# Altium project Charge_Deck.PrjPCB
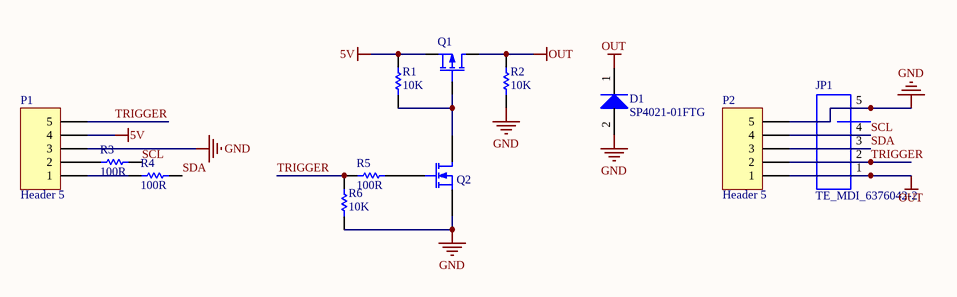
[diagram p0: Charge_Deck.SchDoc]
1 sheet, 12 parts. Net scope: global (net labels, ports and power ports of the same name join across sheets).
Board file: Charge_Deck.PcbDoc

## Sheet Charge_Deck.SchDoc
size A4

### Parts
D1  SP4021-01FTG  [SOD-323]
JP1  TE_MDI_6376042-2  [TE_6376042-2]
P1  Header 5  [HDR1X5]
P2  Header 5  [HDR1X5]
Q1  SI2309CDS-T1-GE3  [SOT23-3]  (value not drawn)
Q2  BSS123WQ-7-F  [SOT323-3]  (value not drawn)
R1  value 10K  [R0603[1608]]  (hidden comment: 10K 1% 0603)
R2  value 10K  [R0603[1608]]  (hidden comment: 10K 1% 0603)
R3  value 100R  [R0603[1608]]  (hidden comment: 100R 1% 0603)
R4  value 100R  [R0603[1608]]  (hidden comment: 100R 1% 0603)
R5  value 100R  [R0603[1608]]  (hidden comment: 100R 1% 0603)
R6  value 10K  [R0603[1608]]  (hidden comment: 10K 1% 0603)

### Nets
5V: P1.4 Q1.3(S) R1.2
GND: D1.2(A) JP1.5 P1.3 P2.5 Q2.2(S) R2.1 R6.1
OUT: D1.1(K) JP1.1 P2.1 Q1.2(D) R2.2
SCL: JP1.4 P2.4 R3.1
SDA: JP1.3 P2.3 R4.1
TRIGGER: JP1.2 P1.5 P2.2 R5.2 R6.2
NetP1_1: P1.1 R4.2
NetP1_2: P1.2 R3.2
NetQ1_1: Q1.1(G) Q2.3(D) R1.1
NetQ2_1: Q2.1(G) R5.1

### Library data of the parts
D1 = SP4021-01FTG: Manufacturer: Littelfuse; PartNumber: SP4021-01FTG; PackageReference: SOD-323-2; Mounting Technology: Surface Mount
JP1 = TE_MDI_6376042-2: BLADE CONNECTOR, 5 PIN, MALE, HORIZ; Manufacturer: TE Connectivity; PartNumber: 6376042-2; Mounting Technology: Through Hole
P1 P2 = Header 5: Header, 5-Pin; LatestRevisionDate: 17-Jul-2002; LatestRevisionNote: Re-released for DXP Platform.; Publisher: Altium Limited
Q1 = SI2309CDS-T1-GE3: P-Channel MOSFET; Manufacturer: Vishay; PackageReference: SOT23-3; Mounting Technology: Surface Mount; PartNumber: SI2309CDS-T1-GE3
Q2 = BSS123WQ-7-F: N-Channel MOSFET; Manufacturer: Diodes Incorporated; PackageReference: SOT-323-3; PartNumber: BSS123WQ-7-F; Mounting Technology: Surface Mount
R1 R2 R6 = RES_10K_0603_1%: 10K 0.25W 1% 0603 (1005 Metric); Manufacturer: Vishay / Dale; PartNumber: CRCW060310K0FKEAHP; Power: 0.25W; Tolerance: 1%; Mounting Technology: Surface Mount; PackageReference: 0603; PackageDescription: 0603 (1608 Metric); ComponentLink1Description: Datasheet; ComponentLink1URL: http://www.vishay.com/docs/20065/rcse3.pdf
R3-R5 = RES_100R_0603_1%: 100R 0.25W 1% 0603 (1005 Metric); Manufacturer: Vishay / Dale; PartNumber: CRCW0603100RFKEAHP; Tolerance: 1%; Power: 0.25W; Mounting Technology: Surface Mount; PackageReference: 0603; PackageDescription: 0603 (1608 Metric); ComponentLink1Description: Datasheet; ComponentLink1URL: http://www.vishay.com/docs/20043/crcwhpe3.pdf